# EAGLE design motor_shield_v1 (EAGLE 9.6.2)
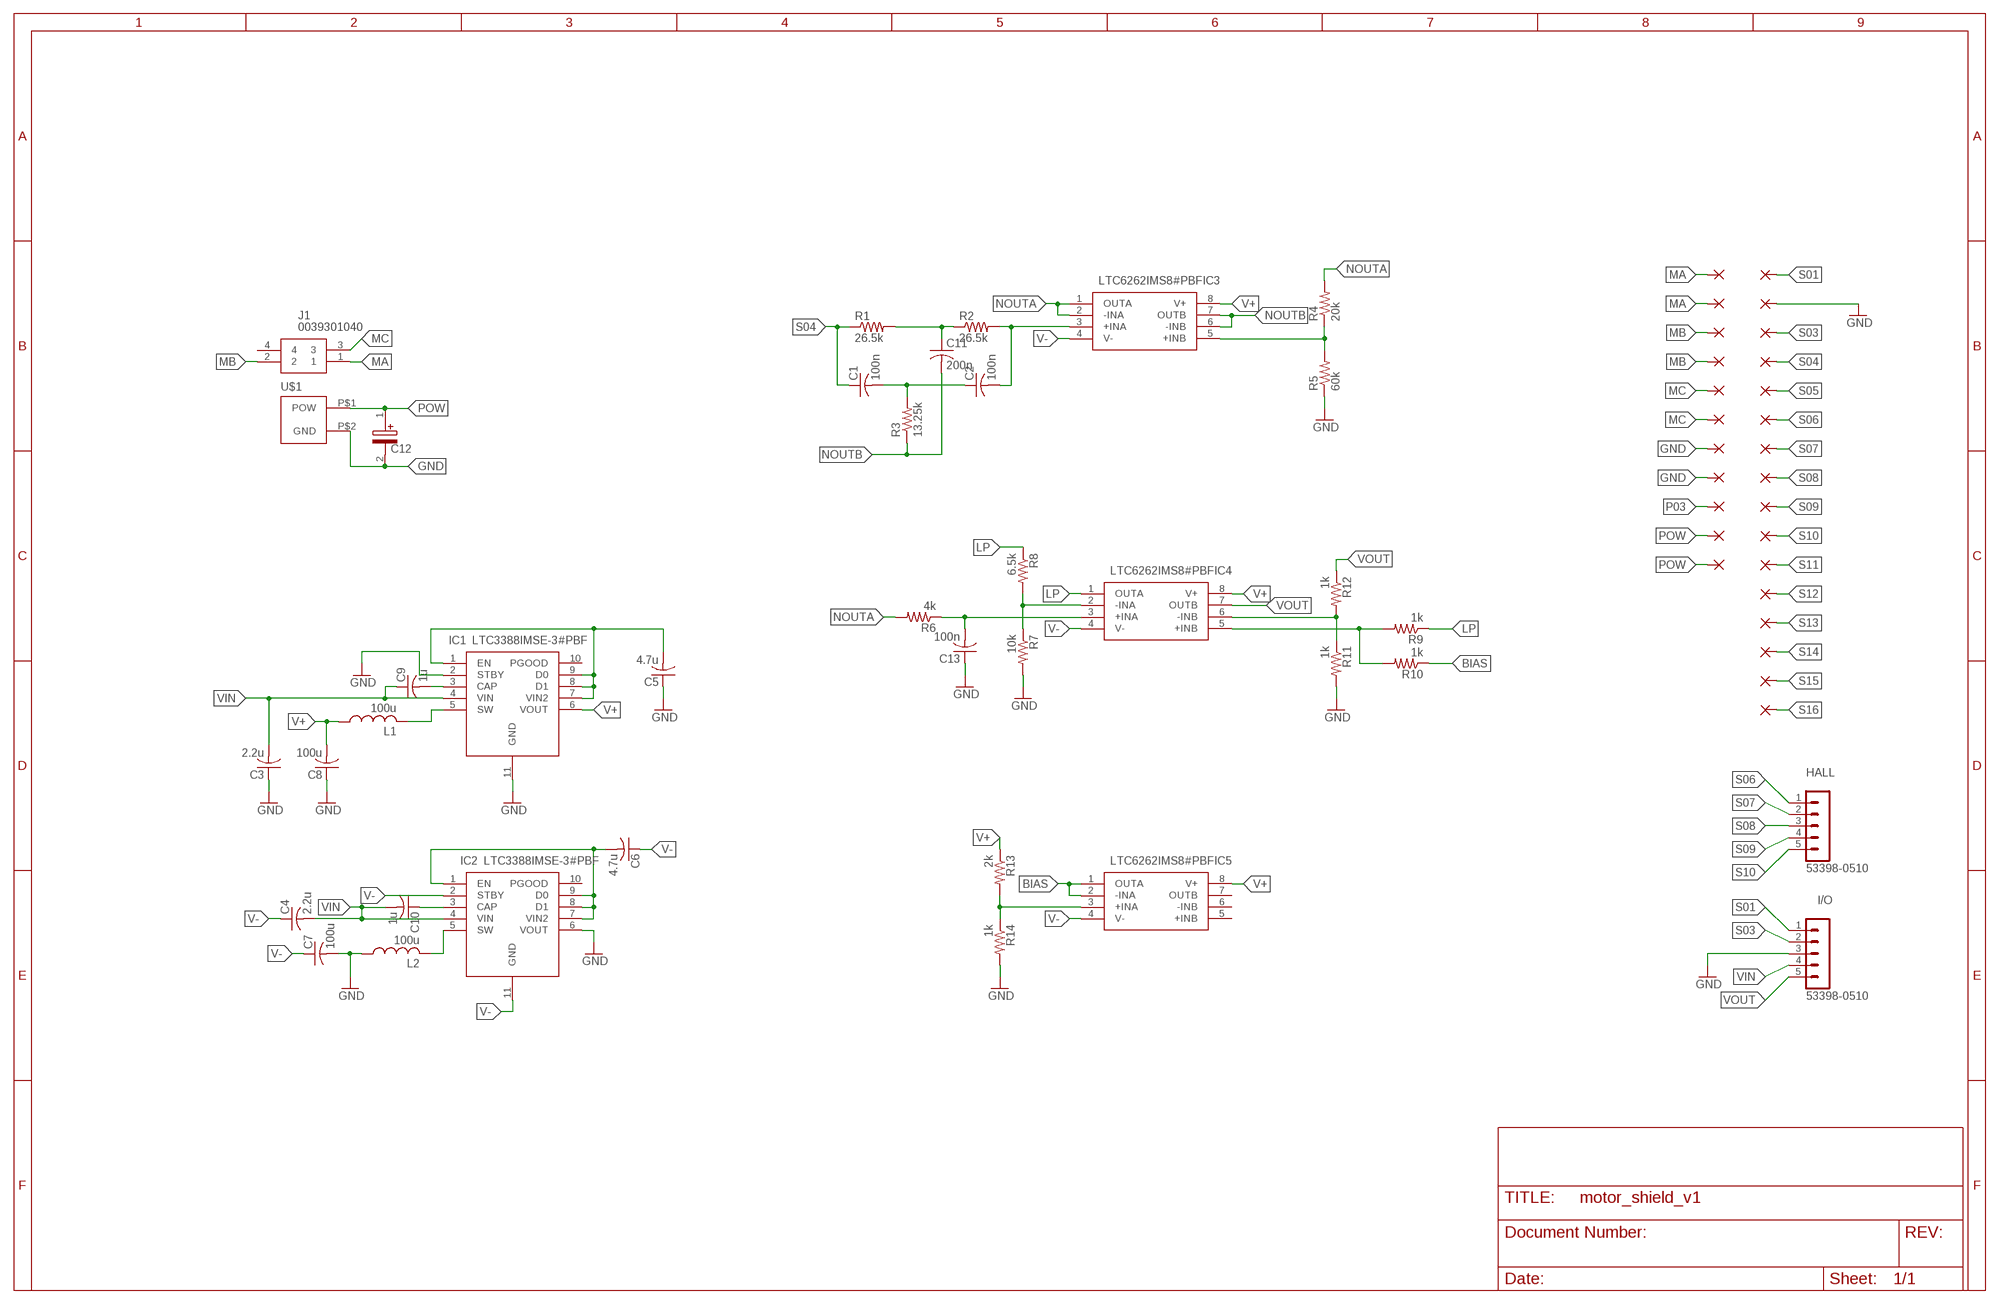
[diagram p0: schematic, sheet 1]

## Parts
C1  100n  C-USC0805  [C0805]
C2  100n  C-USC0805  [C0805]
C3  2.2u  C-USC0805  [C0805]
C4  2.2u  C-USC0805  [C0805]
C5  4.7u  C-USC0805  [C0805]
C6  4.7u  C-USC0805  [C0805]
C7  100u  C-USC0805  [C0805]
C8  100u  C-USC0805  [C0805]
C9  1u  C-USC0805  [C0805]
C10  1u  C-USC0805  [C0805]
C11  200n  C-USC0805  [C0805]
C12  UVR2A101MPD  [CAPPRD500W60D1025H2200]
C13  100n  C-USC0805  [C0805]
HALL  53398-0510  [53398-0510]
I/O  53398-0510  [53398-0510]
IC1  LTC3388IMSE-3#PBF  [SOP50P490X110-11N]
IC2  LTC3388IMSE-3#PBF  [SOP50P490X110-11N]
IC3  LTC6262IMS8#PBF  [SOP65P490X110-8N]
IC4  LTC6262IMS8#PBF  [SOP65P490X110-8N]
IC5  LTC6262IMS8#PBF  [SOP65P490X110-8N]
J1  0039301040  [0039301040]
L1  100u  L-USL2012C  [L2012C]
L2  100u  L-USL2012C  [L2012C]
P01  1,6/0,9  [1,6/0,9]
P02  1,6/0,9  [1,6/0,9]
P03  1,6/0,9  [1,6/0,9]
P04  1,6/0,9  [1,6/0,9]
P05  1,6/0,9  [1,6/0,9]
P06  1,6/0,9  [1,6/0,9]
P07  1,6/0,9  [1,6/0,9]
P08  1,6/0,9  [1,6/0,9]
P09  1,6/0,9  [1,6/0,9]
P10  1,6/0,9  [1,6/0,9]
P11  1,6/0,9  [1,6/0,9]
R1  26.5k  R-US_R0805  [R0805]
R2  26.5k  R-US_R0805  [R0805]
R3  13.25k  R-US_R0805  [R0805]
R4  20k  R-US_R0805  [R0805]
R5  60k  R-US_R0805  [R0805]
R6  4k  R-US_R0805  [R0805]
R7  10k  R-US_R0805  [R0805]
R8  6.5k  R-US_R0805  [R0805]
R9  1k  R-US_R0805  [R0805]
R10  1k  R-US_R0805  [R0805]
R11  1k  R-US_R0805  [R0805]
R12  1k  R-US_R0805  [R0805]
R13  2k  R-US_R0805  [R0805]
R14  1k  R-US_R0805  [R0805]
S01  1,6/0,9  [1,6/0,9]
S02  1,6/0,9  [1,6/0,9]
S03  1,6/0,9  [1,6/0,9]
S04  1,6/0,9  [1,6/0,9]
S05  1,6/0,9  [1,6/0,9]
S06  1,6/0,9  [1,6/0,9]
S07  1,6/0,9  [1,6/0,9]
S08  1,6/0,9  [1,6/0,9]
S09  1,6/0,9  [1,6/0,9]
S10  1,6/0,9  [1,6/0,9]
S11  1,6/0,9  [1,6/0,9]
S12  1,6/0,9  [1,6/0,9]
S13  1,6/0,9  [1,6/0,9]
S14  1,6/0,9  [1,6/0,9]
S15  1,6/0,9  [1,6/0,9]
S16  1,6/0,9  [1,6/0,9]
U$1  JR_2PM_DEV  [JR_2PM_B_FP]

## Nets
BIAS: IC5.1(OUTA) IC5.2(-INA) R10.1
GND: C3.1 C5.1 C7.2 C8.1 C12.2(-) C13.1 I/O.3 IC1.2(STBY) IC1.11(GND) IC2.6(VOUT) L2.1 P07.1(P) P08.1(P) R5.1 R7.2 R11.2 R14.2 S02.1(P) U$1.P$2(GND)
LP: IC4.1(OUTA) R8.1 R9.1
MA: J1.1 P01.1(P) P02.1(P)
MB: J1.2 P03.1(P) P04.1(P)
MC: J1.3 P05.1(P) P06.1(P)
N$1: IC2.5(SW) L2.2
N$2: IC3.5(+INB) R4.1 R5.2
N$3: C2.2 IC3.3(+INA) R2.2
N$4: C13.2 IC4.3(+INA) R6.1
N$5: C11.1 R1.2 R2.1
N$6: C6.2 IC2.1(EN) IC2.7(VIN2) IC2.8(D1) IC2.9(D0)
N$7: C1.2 C2.1 R3.2
N$8: IC4.2(-INA) R7.1 R8.2
N$9: C10.1 IC2.3(CAP)
N$10: IC5.3(+INA) R13.2 R14.1
N$11: IC4.6(-INB) R11.1 R12.2
N$12: IC4.5(+INB) R9.2 R10.2
N$16: C5.2 IC1.1(EN) IC1.7(VIN2) IC1.8(D1) IC1.9(D0)
N$20: C9.2 IC1.3(CAP)
N$22: IC1.5(SW) L1.2
NOUTA: IC3.1(OUTA) IC3.2(-INA) R4.2 R6.2
NOUTB: C11.2 IC3.6(-INB) IC3.7(OUTB) R3.1
P03: P09.1(P)
POW: C12.1(+) P10.1(P) P11.1(P) U$1.P$1(POW)
S01: I/O.1 S01.1(P)
S03: I/O.2 S03.1(P)
S04: C1.1 R1.1 S04.1(P)
S05: S05.1(P)
S06: HALL.1 S06.1(P)
S07: HALL.2 S07.1(P)
S08: HALL.3 S08.1(P)
S09: HALL.4 S09.1(P)
S10: HALL.5 S10.1(P)
S11: S11.1(P)
S12: S12.1(P)
S13: S13.1(P)
S14: S14.1(P)
S15: S15.1(P)
S16: S16.1(P)
V+: C8.2 IC1.6(VOUT) IC3.8(V+) IC4.8(V+) IC5.8(V+) L1.1 R13.1
V-: C4.1 C6.1 C7.1 IC2.2(STBY) IC2.11(GND) IC3.4(V-) IC4.4(V-) IC5.4(V-)
VIN: C3.2 C4.2 C9.1 C10.2 I/O.4 IC1.4(VIN) IC2.4(VIN)
VOUT: I/O.5 IC4.7(OUTB) R12.1
Unconnected: IC1.10(PGOOD) IC2.10(PGOOD) IC5.5(+INB) IC5.6(-INB) IC5.7(OUTB) J1.4

## Library data of the parts
C1-C11 C13 = rcl:C-US: CAPACITOR, American symbol; SPICEPREFIX: C
C12 = UVR2A101MPD:UVR2A101MPD: Nichicon 100uF 100 V Aluminium Electrolytic Capacitor, VR Series 2000h 10 x 20mm Source: Datasheet <http://www.nichicon.co.jp/english/products/pdfs/e-vr.pdf>; ARROW_PART_NUMBER: UVR2A101MPD; ARROW_PRICE-STOCK: https://www.arrow.com/en/products/uvr2a101mpd/nichicon; DESCRIPTION: Nichicon 100uF 100 V Aluminium Electrolytic Capacitor, VR Series 2000h 10 x 20mm; HEIGHT: 22mm; MANUFACTURER_NAME: Nichicon; MANUFACTURER_PART_NUMBER: UVR2A101MPD; MOUSER_PART_NUMBER: 647-UVR2A101MPD; MOUSER_PRICE-STOCK: https://www.mouser.co.uk/ProductDetail/Nichicon/UVR2A101MPD?qs=oFjv9VeDysFDkdsOpEtv6w%3D%3D
HALL I/O = con-molex-picoblade:53398-0510: HEADER
IC1 IC2 = LTC3388IMSE-3#PBF:LTC3388IMSE-3#PBF: Switching Voltage Regulators 20V/50mA High Efficiency Step-Down Regulator with <1uA Quiescent Current Source: Datasheet <https://www.analog.com/media/en/technical-documentation/data-sheets/338813fa.pdf>; ARROW_PART_NUMBER: LTC3388IMSE-3#PBF; ARROW_PRICE-STOCK: https://www.arrow.com/en/products/ltc3388imse-3pbf/analog-devices?region=nac; DESCRIPTION: Switching Voltage Regulators 20V/50mA High Efficiency Step-Down Regulator with <1uA Quiescent Current; HEIGHT: 1.1mm; MANUFACTURER_NAME: Analog Devices; MANUFACTURER_PART_NUMBER: LTC3388IMSE-3#PBF; MOUSER_PART_NUMBER: 584-LTC3388IMSE-3PBF; MOUSER_PRICE-STOCK: https://www.mouser.co.uk/ProductDetail/Analog-Devices/LTC3388IMSE-3PBF?qs=hVkxg5c3xu%252BRZEM3kCY9DA%3D%3D
IC3-IC5 = SamacSys_Parts:LTC6262IMS8#PBF: Op Amp Dual Precision Amplifier R-R I/O +/-2.625V/5.25V Automotive 8-Pin MSOP Tube Source: Datasheet <https://www.analog.com/media/en/technical-documentation/data-sheets/626123fa.pdf>; DESCRIPTION: Op Amp Dual Precision Amplifier R-R I/O +/-2.625V/5.25V Automotive 8-Pin MSOP Tube; HEIGHT: 1.1mm; MANUFACTURER_NAME: Analog Devices; MANUFACTURER_PART_NUMBER: LTC6262IMS8#PBF; MOUSER_PART_NUMBER: 584-LTC6262IMS8#PBF; MOUSER_PRICE-STOCK: https://www.mouser.co.uk/ProductDetail/Analog-Devices/LTC6262IMS8PBF?qs=oahfZPh6IAIHw3cao8dNmA%3D%3D
J1 = 0039301040:0039301040: Conn Wire to Board HDR 4Power POS 4.2mm Solder RA Side Entry Thru-Hole Bag Source: Datasheet <https://www.molex.com/pdm_docs/pk/PK-5569-002.pdf>; ARROW_PART_NUMBER: 0039301040; ARROW_PRICE-STOCK: https://www.arrow.com/en/products/0039301040/molex?region=nac; DESCRIPTION: Conn Wire to Board HDR 4Power POS 4.2mm Solder RA Side Entry Thru-Hole Bag; HEIGHT: 10mm; MANUFACTURER_NAME: Molex; MANUFACTURER_PART_NUMBER: 0039301040; MOUSER_PART_NUMBER: N/A; MOUSER_PRICE-STOCK: https://www.mouser.co.uk/ProductDetail/Molex/0039301040?qs=PBcRNPEHKsrbVy%2FlkLEDxA%3D%3D
L1 L2 = rcl:L-US: INDUCTOR, American symbol; SPICEPREFIX: L
P01-P09 P10 P11 S01-S09 S10-S16 = wirepad:1,6/0,9: THROUGH-HOLE PAD
R1-R14 = rcl:R-US_: RESISTOR, American symbol; SPICEPREFIX: R
U$1 = molex_power_connector:JR_2PM_DEV

## Board
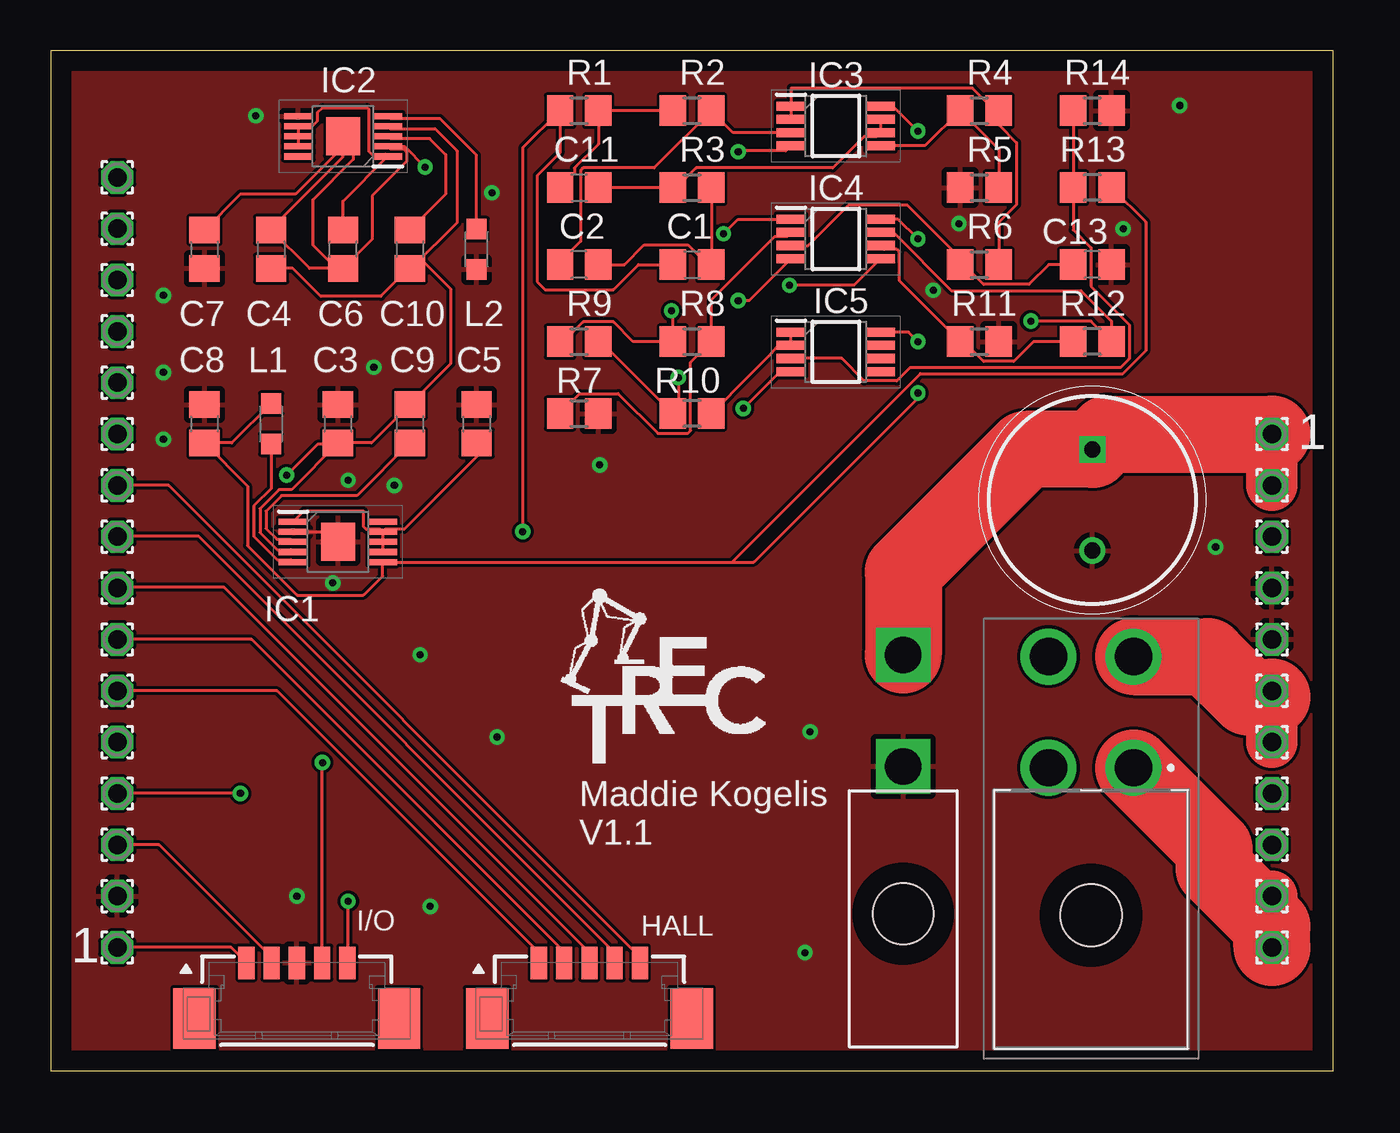
[diagram p1: board, top side]
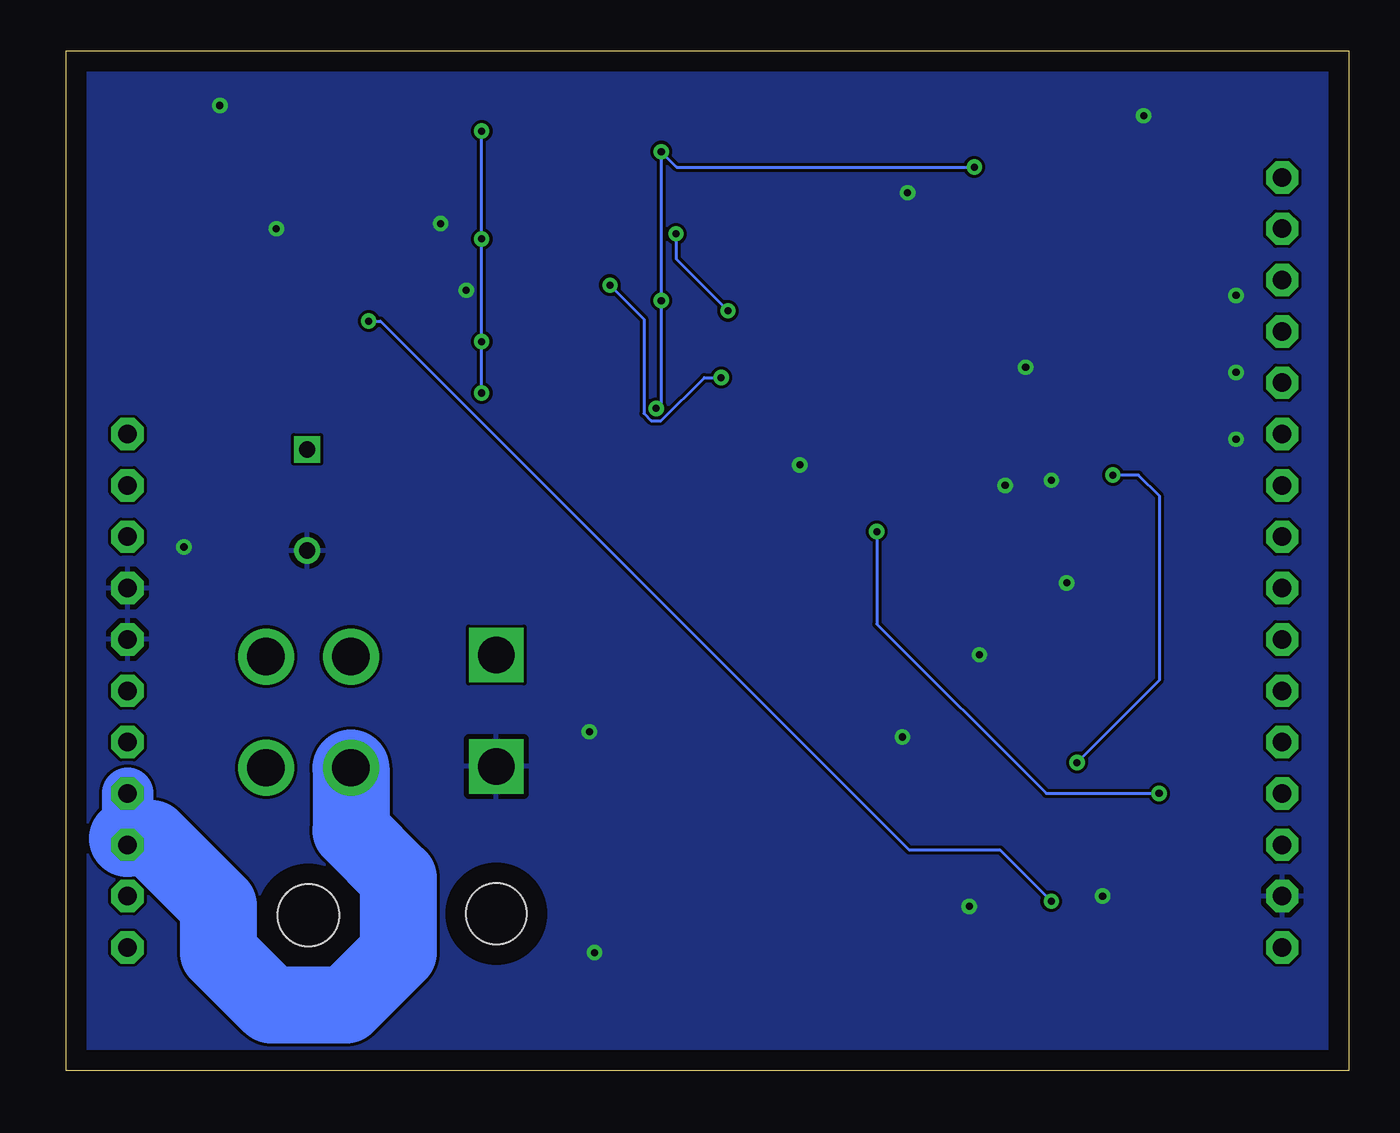
[diagram p2: board, bottom side, seen from below]

Size 63.48 x 50.47 mm. Coordinates in mm from the lower left corner, seen from the top.
Outline: 0,0 63.48,0 63.48,50.47 0,50.47 0,0
Copper layers (1*16): Top 0.035mm / dielectric 1.5mm / Bottom 0.035mm
Design rules "default": minimum track width 6mil, minimum drill 0.35mm, track to track 6mil, track to pad 6mil, pad to pad 6mil, via to via 6mil, smd to smd 6mil, copper to edge 40mil, drill to drill 6mil, minimum pad ring 10mil, minimum via ring 8mil, stop-mask expansion 4mil, vias tented up to drill 0mil, thermal gap 10mil

### Footprints (pad centres in the part's own frame; a part is rotated, then mirrored left to right if it is on the bottom)
C0805 = smd 1.3 x 1.5: 1 -0.95,0; 2 0.95,0
CAPPRD500W60D1025H2200 = drill 0.8 pad 1.2 square: 1 0,0 | drill 0.8 pad 1.2: 2 5,0
53398-0510 = smd 0.8 x 1.6: 1 2.5,0; 2 1.25,0; 3 0,0; 4 -1.25,0; 5 -2.5,0 | smd 2.1 x 3: M1 5.06,2.75; M2 -5.06,2.75
SOP50P490X110-11N = smd 1.425 x 0.3: 1 -2.212,1; 2 -2.212,0.5; 3 -2.212,0; 4 -2.212,-0.5; 5 -2.212,-1; 6 2.212,-1; 7 2.212,-0.5; 8 2.212,0; 9 2.212,0.5; 10 2.212,1 | smd 1.68 x 1.88: 11 0,0
SOP65P490X110-8N = smd 1.425 x 0.45: 1 -2.212,0.975; 2 -2.212,0.325; 3 -2.212,-0.325; 4 -2.212,-0.975; 5 2.212,-0.975; 6 2.212,-0.325; 7 2.212,0.325; 8 2.212,0.975
0039301040 = drill 1.85 pad 2.775: 1 0,0; 2 -4.2,0; 3 0,5.5; 4 -4.2,5.5 | hole 3.05: -2.1,-7.3
L2012C = smd 1 x 1: 1 -1,0; 2 1,0
1,6/0,9 = drill 0.914 pad 1.6 octagon: 1 0,0
R0805 = smd 1.3 x 1.5: 1 -0.95,0; 2 0.95,0
JR_2PM_B_FP = drill 1.803 square: P$1 2.667,19.406; P$2 2.667,13.894 | hole 2.997: 2.667,6.604

### Placement (x,y rotation side)
C1  31.75,39.88 0 top
C2  26.16,39.88 180 top
C3  14.22,32 270 top
C4  10.92,40.64 270 top
C5  21.08,32 270 top
C6  14.48,40.64 90 top
C7  7.62,40.64 270 top
C8  7.62,32 270 top
C9  17.78,32 270 top
C10  17.78,40.64 270 top
C11  26.16,43.69 0 top
C12  51.56,30.73 270 top
C13  51.56,39.88 180 top
HALL  26.67,5.33 180 top
I/O  12.19,5.33 180 top
IC1  14.22,26.16 0 top
IC2  14.48,46.23 180 top
IC3  38.86,46.74 0 top
IC4  38.86,41.15 0 top
IC5  38.86,35.56 0 top
J1  53.59,14.99 0 top
L1  10.92,32 270 top
L2  21.08,40.64 90 top
P01  60.45,6.1 0 top
P02  60.45,8.64 0 top
P03  60.45,11.18 0 top
P04  60.45,13.72 0 top
P05  60.45,16.26 0 top
P06  60.45,18.8 0 top
P07  60.45,21.34 0 top
P08  60.45,23.88 0 top
P09  60.45,26.42 0 top
P10  60.45,28.96 0 top
P11  60.45,31.5 0 top
R1  26.16,47.5 0 top
R2  31.75,47.5 0 top
R3  31.75,43.69 0 top
R4  45.97,47.5 0 top
R5  45.97,43.69 0 top
R6  45.97,39.88 0 top
R7  26.16,32.51 0 top
R8  31.75,36.07 0 top
R9  26.16,36.07 0 top
R10  31.75,32.51 180 top
R11  45.97,36.07 0 top
R12  51.56,36.07 180 top
R13  51.56,43.69 180 top
R14  51.56,47.5 0 top
S01  3.3,6.1 0 top
S02  3.3,8.64 0 top
S03  3.3,11.18 0 top
S04  3.3,13.72 0 top
S05  3.3,16.26 0 top
S06  3.3,18.8 0 top
S07  3.3,21.34 0 top
S08  3.3,23.88 0 top
S09  3.3,26.42 0 top
S10  3.3,28.96 0 top
S11  3.3,31.5 0 top
S12  3.3,34.04 0 top
S13  3.3,36.58 0 top
S14  3.3,39.12 0 top
S15  3.3,41.66 0 top
S16  3.3,44.2 0 top
U$1  39.53,1.16 0 top

### Tracks (layer width: path | path; a pad name or v marks a point on that pad's centre or on a via)
BIAS
  Top 0.152: R10.1 34.64,34.45 35.71,35.52 35.71,35.55 36.04,35.88 IC5.2 IC5.1
GND  (via drill 0.35)
  Top 0.152: IC1.2 13.72,26.66 IC1.11
  other vias: 27.18,29.97 5.59,38.35 16,34.8 17.02,28.96 5.59,34.54 12.19,8.64 22.1,16.51 37.34,5.84 18.29,20.57 18.8,8.13 5.59,31.24 10.16,47.24 37.59,16.76 21.84,43.43 14.73,29.21 13.97,24.13 57.66,25.91 43.69,38.61 44.96,41.91 53.09,41.66 55.88,47.75
  pour Top: -6.35,53.34 -3.81,55.88 65.79,55.88 68.83,52.83 68.83,-0.76 63.25,-6.35 -1.27,-6.35 -6.35,-1.27
  pour Bottom: -6.35,53.59 -4.06,55.88 65.79,55.88 68.83,52.83 68.83,-1.02 63.5,-6.35 -1.02,-6.35 -6.35,-1.02
LP  (via drill 0.35)
  Top 0.152: R9.1 25.39,36.07 26.37,37.05 27.86,37.05 28.84,36.07 R8.1 30.8,37.53 v30.73,37.59 | v33.31,41.4 34.03,42.12 IC4.1
  Bottom 0.152: v30.73,37.59 33.27,40.13 33.27,41.4 v33.31,41.4
MA
  Top 2.54: P01.1 P02.1
  Top 3.81: J1.1 57.59,10.99 57.59,9.99 60.45,7.13 P01.1
MB
  Bottom 2.54: P03.1 60.45,11.49 P04.1
  Bottom 3.81: 60.45,11.49 59.27,11.49 55.94,8.16 55.94,5.84 53.34,3.24 49.65,3.24 47.05,5.84 47.05,9.53 49.39,11.87 J1.2
MC
  Top 2.54: P05.1 60.45,18.48 P06.1
  Top 3.81: 60.45,18.48 59.27,18.48 57.26,20.49 J1.3
N$1
  Top 0.152: IC2.5 16.81,47.11 19.27,47.11 21.08,45.3 L2.2
N$2
  Top 0.152: R5.2 46.92,45.6 R4.1 43.29,45.76 IC3.5
N$3
  Top 0.152: IC3.3 33.79,46.41 R2.2 29.87,44.67 26.37,44.67 26.23,44.53 26.23,41.03 25.21,40.01 C2.2
N$4
  Top 0.152: C13.2 49.41,39.88 48.43,38.9 46.18,38.9 45.2,39.88 R6.1 45.02,40.2 42.39,42.83 39.51,42.83 37.5,40.82 IC4.3
N$5
  Top 0.152: R2.1 R1.2 27.11,45.84 25.93,44.66 25.93,44.41 C11.1
N$6
  Top 0.152: C6.2 14.48,43.02 IC2.1 16.57,45.35 15.88,45.35 15.75,45.48 15.75,47.57 15.67,47.65 13.46,47.65 13.21,47.4 13.21,46.98 12.95,46.73 IC2.7 IC2.8 IC2.9
N$7
  Top 0.152: R3.2 C1.2 32.52,39.88 31.55,40.86 29.38,40.86 28.4,39.88 C2.1
N$8
  Top 0.152: IC4.2 36.45,41.28 35.84,41.28 32.7,38.13 R8.2 31.68,35.05 31.68,31.67 31.55,31.53 30.05,31.53 28.1,33.49 26.19,33.49 R7.1
N$9
  Top 0.152: C10.1 19.56,43.37 19.56,45.32 18.77,46.11 16.81,46.11 IC2.3
N$10
  Top 0.152: R14.1 R13.2 50.61,41.6 51.49,40.72 51.49,38.81 53.39,36.91 53.39,35.22 52.95,34.78 42.53,34.78 41.88,34.13 40.27,34.13 39.16,35.23 IC5.3
N$11
  Top 0.152: R12.2 48.65,36.07 47.67,35.09 46.18,35.09 45.2,36.07 R11.1 42.02,39.08 42.02,40.49 41.88,40.63 41.27,40.63 IC4.6
N$12  (via drill 0.35)
  Top 0.152: R9.2 27.24,36.07 R10.2 31.07,32.78 v31.07,34.29 | IC4.5 39.76,38.86 v36.58,38.86
  Bottom 0.152: v36.58,38.86 34.9,37.18 34.9,32.52 34.54,32.16 34.04,32.16 31.91,34.29 v31.07,34.29
N$16
  Top 0.152: IC1.9 16.56,26.78 17.5,26.78 21.08,30.37 C5.2 | IC1.9 IC1.8 IC1.7 | IC1.9 16.32,26.78 15.63,26.78 15.49,26.92 15.49,27.69 12.54,27.69 IC1.1
N$20
  Top 0.152: C9.2 15.17,28.45 11.43,28.45 10.67,27.69 10.67,26.82 11.21,26.28 11.89,26.28 IC1.3
N$22
  Top 0.152: IC1.5 11.89,25.28 11.21,25.28 10.06,26.43 10.06,27.94 10.92,28.8 L1.2
NOUTA
  Top 0.152: R6.2 46.92,41.97 47.8,42.84 47.8,45.91 46.92,46.79 R4.2 46.75,47.5 45.63,48.62 36.65,48.62 IC3.1 IC3.2
NOUTB
  Top 0.152: C11.2 R3.1 30.98,43.69 31.95,44.67 38.72,44.67 40.27,46.22 40.88,46.22 IC3.6 IC3.7
POW
  Top 2.54: P10.1 P11.1
  Top 3.81: U$1.P$1 42.2,24.68 48.26,30.73 C12.1 52.32,31.5 P11.1
S01
  Top 0.152: I/O.1 8.93,6.1 S01.1
S03
  Top 0.152: I/O.2 10.94,5.61 5.37,11.18 S03.1
S04  (via drill 0.35)
  Top 0.152: v9.4,13.72 S04.1 | C1.1 29.09,39.88 27.86,38.65 24.47,38.65 24.08,39.03 24.08,44.28 25.21,45.41 R1.1 23.37,45.65 v23.37,26.67
  Bottom 0.152: v23.37,26.67 23.37,22.1 14.99,13.72 v9.4,13.72
S06
  Top 0.152: HALL.1 24.17,5.84 11.22,18.8 S06.1
S07
  Top 0.152: HALL.2 25.31,5.45 25.31,5.97 9.95,21.34 S07.1
S08
  Top 0.152: HALL.3 26.92,5.59 8.59,23.92 3.35,23.92 S08.1
S09
  Top 0.152: HALL.4 27.92,5.84 7.32,26.44 3.33,26.44 S09.1
S10
  Top 0.152: HALL.5 29.06,5.45 29.06,5.74 5.84,28.96 S10.1
V+  (via drill 0.35)
  Top 0.152: L1.1 8.97,31.05 C8.2 9.75,28.92 9.75,25.98 12.21,23.52 15.49,23.52 16.44,24.47 IC1.6 | IC1.6 33.73,25.16 43.05,34.48 53.08,34.48 54.2,35.6 54.2,42 R13.1 | IC1.6 34.81,25.16 42.93,33.27 v42.93,33.53 | v42.93,36.07 42.46,36.53 IC5.8 | v42.93,41.15 41.95,42.12 IC4.8 | v42.93,46.48 41.7,47.71 IC3.8
  Bottom 0.152: v42.93,33.53 v42.93,36.07 v42.93,41.15 v42.93,46.48
V-  (via drill 0.35)
  Top 0.152: IC2.11 14.48,45.72 12.13,43.37 9.4,43.37 C7.1 | IC2.11 14.48,45.21 10.92,41.66 C4.1 12.82,39.69 C6.1 | C6.1 14.15,39.69 12.99,40.84 12.99,43.1 14.99,45.09 14.99,45.72 IC2.11 | C6.1 15.93,41.14 15.93,43.28 17.63,44.98 17.63,45.47 17.5,45.61 16.81,45.61 IC2.2 17.52,45.73 v18.54,44.7 | v34.04,45.47 34.08,45.51 36.4,45.51 IC3.4 | IC4.4 34.58,38.1 v34.04,38.1 | IC5.4 36.11,34.59 v34.29,32.77
  Bottom 0.152: v18.54,44.7 33.27,44.7 v34.04,45.47 v34.04,38.1 34.04,33.02 v34.29,32.77
VIN  (via drill 0.35)
  Top 0.152: C3.2 15.88,31.05 C9.1 19.81,34.99 19.81,38.67 18.29,40.2 C10.2 | IC1.4 11.89,25.78 11.21,25.78 10.36,26.62 10.36,27.81 11.3,28.75 11.92,28.75 C3.2 | IC2.4 16.81,46.61 19.02,46.61 20.12,45.51 20.12,41.95 17.86,39.69 C10.2 | C10.2 17.73,39.69 16.34,38.3 13.38,38.3 11.99,39.69 C4.2 | I/O.4 13.44,15.22 v13.46,15.24 | v11.68,29.46 13.21,30.99 14.16,30.99 C3.2
  Bottom 0.152: v13.46,15.24 9.4,19.3 9.4,28.45 10.41,29.46 v11.68,29.46
VOUT  (via drill 0.35)
  Top 0.152: I/O.5 14.69,8.34 v14.73,8.38 | IC4.7 41.71,41.47 44.58,38.59 51,38.59 52.51,37.08 R12.1 51.5,37.08 v48.51,37.08
  Bottom 0.152: v48.51,37.08 47.93,37.08 21.77,10.92 17.27,10.92 v14.73,8.38

### Text on the board
tNames: 1 | Maddie Kogelis / V1.1 | 1